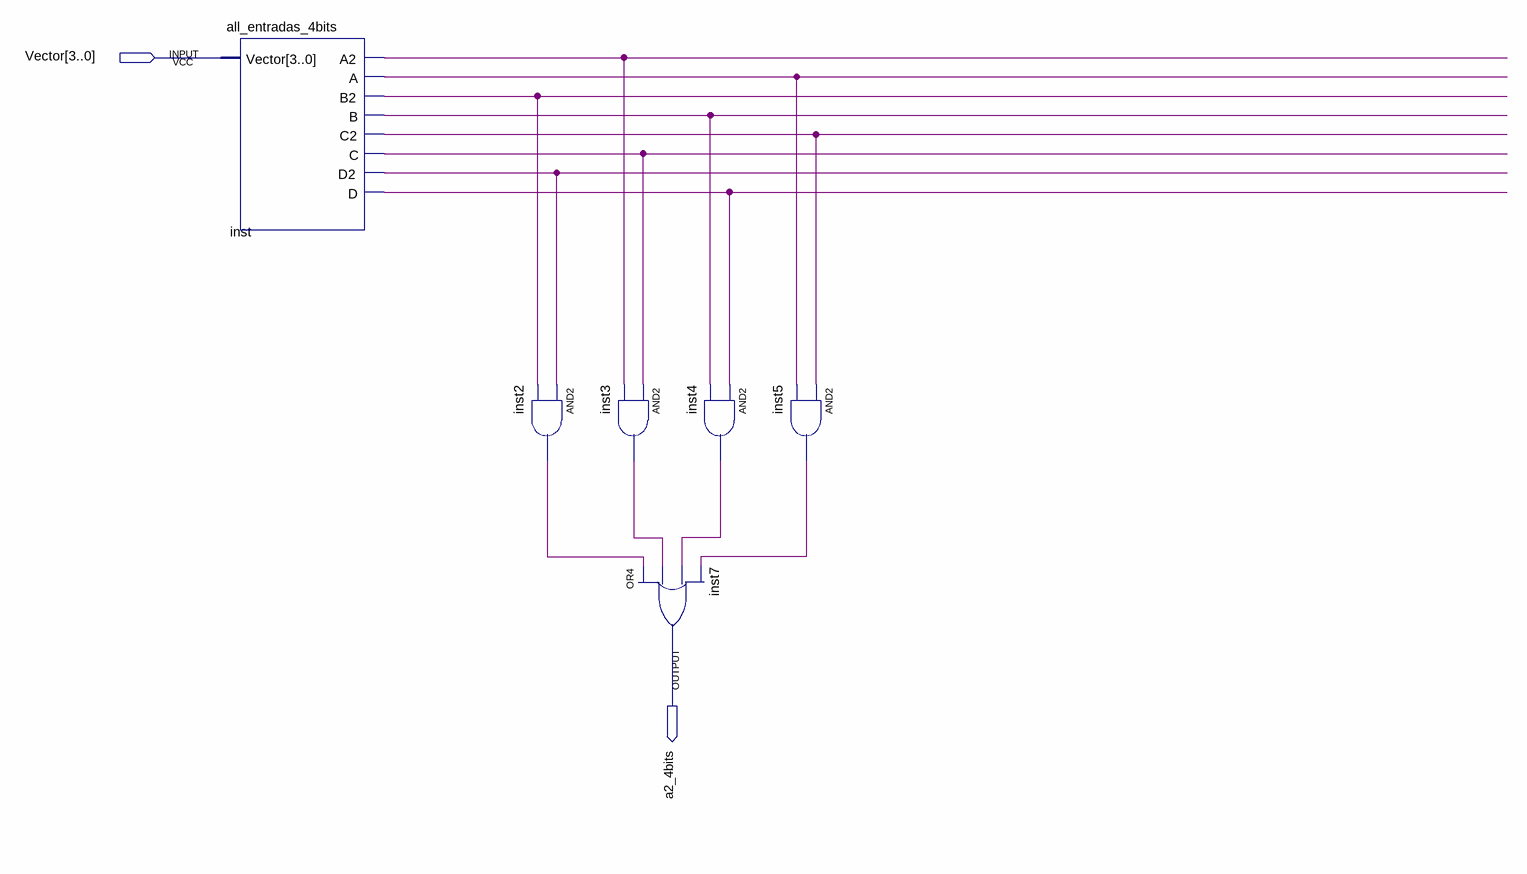
[diagram p0: schematic sheet]
// Quartus schematic a2_4bits.bdf as structural Verilog: 6 symbols, 2 pins
module a2_4bits (
  input  [3:0] Vector,
  output a2_4bits
);

  wire inst2_out, inst3_out, inst4_out, inst5_out, inst_a, inst_a2, inst_b, inst_b2, inst_c, inst_c2, inst_d,
       inst_d2;

  all_entradas_4bits inst (
    .Vector(Vector), .A2(inst_a2), .A(inst_a), .B2(inst_b2), .B(inst_b), .C2(inst_c2), .C(inst_c),
    .D2(inst_d2), .D(inst_d));
  and inst2 (inst2_out, inst_d2, inst_b2);
  and inst3 (inst3_out, inst_c, inst_a2);
  or inst7 (a2_4bits, inst2_out, inst3_out, inst4_out, inst5_out);
  and inst4 (inst4_out, inst_d, inst_b);
  and inst5 (inst5_out, inst_c2, inst_a);
endmodule
